# EAGLE design untitled (EAGLE 8.2.2)
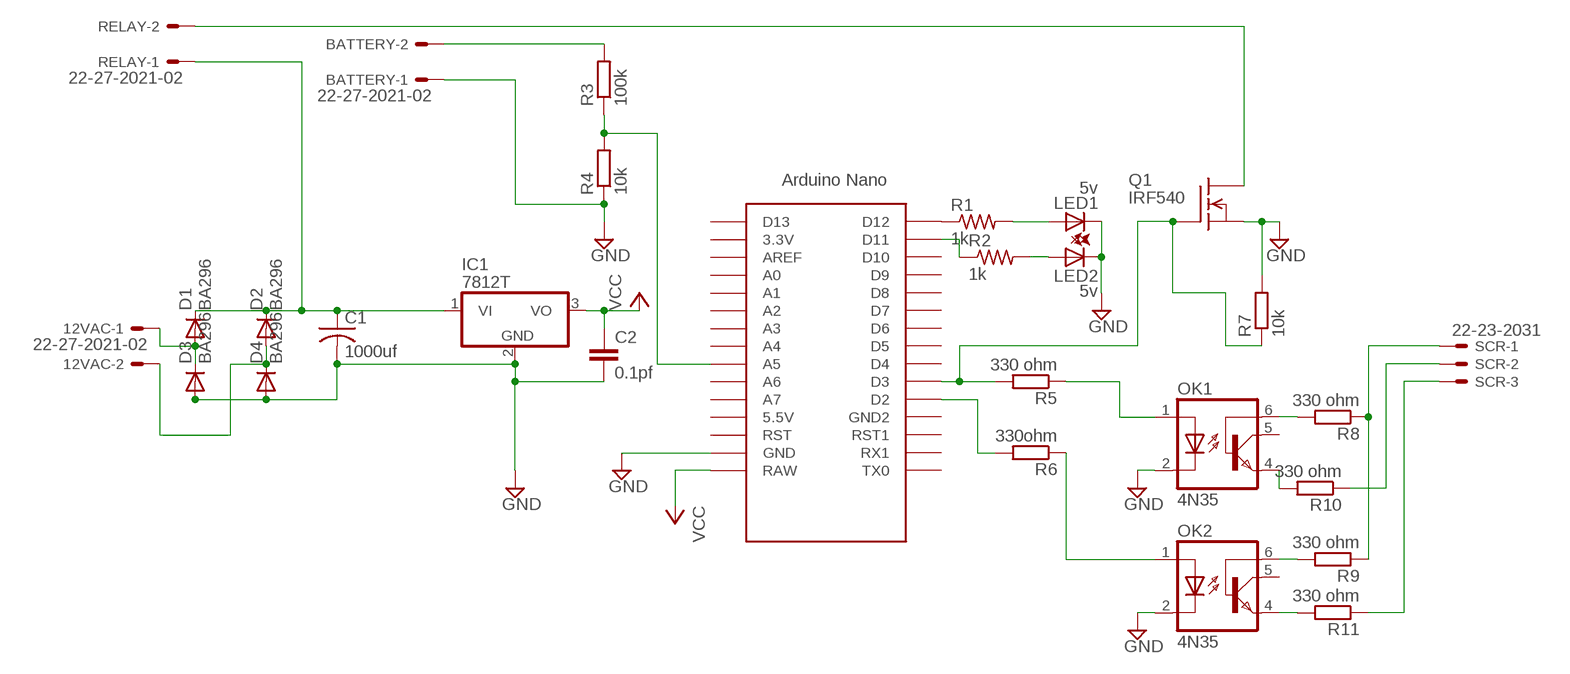
[diagram p0: schematic, sheet 1]

## Parts
12VAC  22-27-2021-02  [6410-02]
BATTERY  22-27-2021-02  [6410-02]
C1  1000uf  C-US050-025X075  [C050-025X075]
C2  0.1pf  C7.5/4  [C7.5B4]
D1  BA296  [P2-15]
D2  BA296  [P2-15]
D3  BA296  [P2-15]
D4  BA296  [P2-15]
IC1  7812T  [TO220H]
LED1  5v  LED_E  [LED_1206]
LED2  5v  LED_E  [LED_1206]
OK1  4N35  [DIL06]
OK2  4N35  [DIL06]
Q1  IRF540  [TO220]
R1  1k  R-US_0207/2V  [0207/2V]
R2  1k  R-US_0207/2V  [0207/2V]
R3  100k  R0207/10  [0207/10]
R4  10k  R0207/10  [0207/10]
R5  330 ohm  R0207/10  [0207/10]
R6  330ohm  R0207/10  [0207/10]
R7  10k  R0207/10  [0207/10]
R8  330 ohm  R0207/10  [0207/10]
R9  330 ohm  R0207/10  [0207/10]
R10  330 ohm  R0207/10  [0207/10]
R11  330 ohm  R0207/10  [0207/10]
RELAY  22-27-2021-02  [6410-02]
SCR  22-23-2031  [22-23-2031]
U$1  NANO  [NANO]

## Nets
GND: BATTERY.1 C1.2 C2.2 D3.A D4.A IC1.2(GND) LED1.C LED2.C OK1.2(C) OK2.2(C) Q1.3(S) R4.1 R7.2 U$1.GND
N$1: R10.1 SCR.2
N$3: R6.2 U$1.D2
N$4: BATTERY.2 R3.2
N$5: 12VAC.1 D1.A D3.C
N$6: 12VAC.2 D2.A D4.C
N$7: R1.1 U$1.D12
N$8: LED2.A R2.2
N$9: LED1.A R1.2
N$10: R2.1 U$1.D11
N$11: Q1.1(G) R5.2 R7.1 U$1.D3
N$12: OK1.1(A) R5.1
N$13: R3.1 R4.2 U$1.A5
N$15: OK2.1(A) R6.1
N$16: Q1.2(D) RELAY.2
N$17: C1.1 D1.C D2.C IC1.1(VI) RELAY.1
N$18: R11.1 SCR.3
N$19: OK1.4(EMI) R10.2
N$20: R8.1 R9.1 SCR.1
N$21: OK1.6(BAS) R8.2
N$22: OK2.6(BAS) R9.2
N$23: OK2.4(EMI) R11.2
VCC: C2.1 IC1.3(VO) U$1.RAW
Unconnected: OK1.5(COL) OK2.5(COL) U$1.3.3V U$1.5V(5.5V) U$1.A0 U$1.A1 U$1.A2 U$1.A3 U$1.A4 U$1.A6 U$1.A7 U$1.AREF U$1.D4 U$1.D5 U$1.D6 U$1.D7 U$1.D8 U$1.D9 U$1.D10 U$1.D13 U$1.GND1(GND2) U$1.ICSP1 U$1.ICSP2 U$1.ICSP3 U$1.ICSP4 U$1.ICSP5 U$1.ICSP6 U$1.RST U$1.RST1 U$1.RX1 U$1.TX0

## Library data of the parts
12VAC BATTERY RELAY = con-molex:22-?-02: CONNECTOR wire to board 2.54 mm (.1 inch) pitch header; OC_FARNELL: unknown; OC_NEWARK: unknown
C1 = rcl:C-US: CAPACITOR, American symbol; C1: 1000uf
C2 = capacitor-wima:C: CAPACITOR naming: grid - package width; C2: 0.1pf
D1-D4 = diode:BA296: DIODE
IC1 = linear:78*: Positive VOLTAGE REGULATOR Source: http://cache.national.com/ds/LM/LM78L05.pdf http://www.fairchildsemi.com/ds/LM/LM7805.pdf
LED1 LED2 = eagle-ltspice:LED_E: LED Source: http://www.osram.convergy.de Source: www.luxeon.com Source: www.kingbright.com; SPICEMODEL: NONE; SPICEPREFIX: D; SPICETYPE: diode
OK1 OK2 = optocoupler:4N35: MOTOROLA OPTO COUPLER; MF: FAIRCHILD SEMICONDUCTOR; MPN: 4N35; OC_FARNELL: 1328375; OC_NEWARK: 72K9946
Q1 = transistor-fet:IRF540: N-Channel Enhancement MOSFET (HEXFET); 100V; 28A; 0,077Ohm
R1 = rcl:R-US_: RESISTOR, American symbol; R1: 1k
R2 = rcl:R-US_: RESISTOR, American symbol; R2: 1k
R3-R11 = eagle-ltspice:R: RESISTOR, European symbol; SPICEMODEL: NONE; SPICEPREFIX: R
SCR = con-molex:22-23-2031: .100" (2.54mm) Center Header - 3 Pin; MF: MOLEX; MPN: 22-23-2031; OC_FARNELL: 1462950; OC_NEWARK: 30C0862
U$1 = Arduino-clone:NANO: Arduino Nano

## Net classes
0 mine: width 0.61 mm, drill 0.762 mm, clearance 0.152 mm

## Board
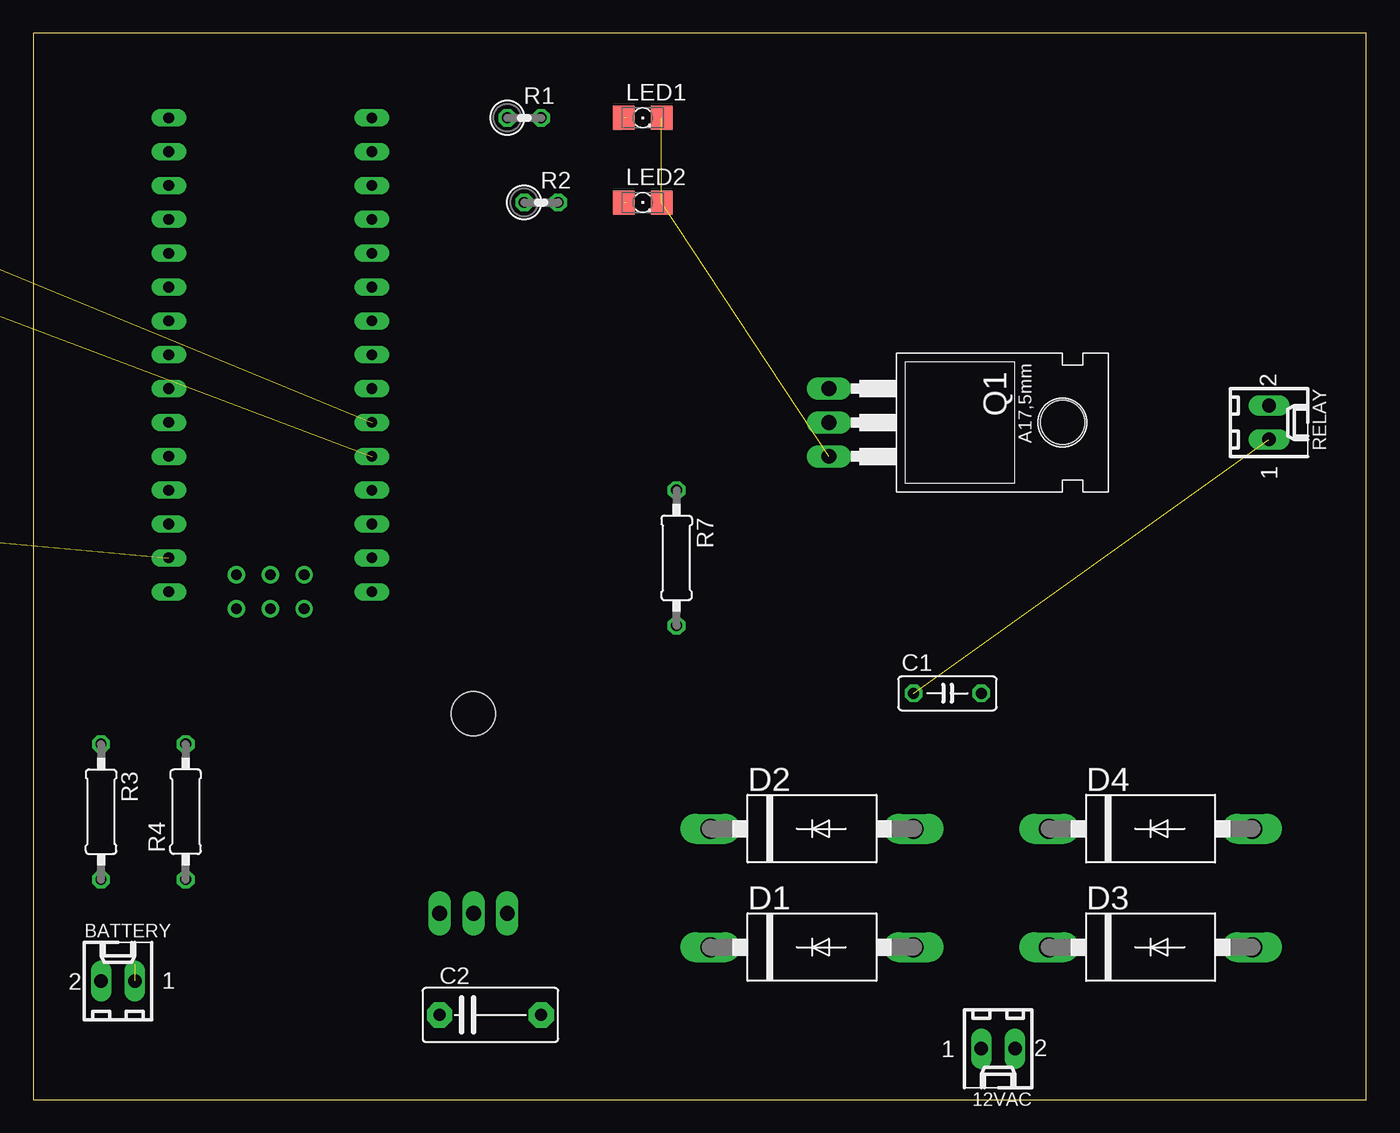
[diagram p1: board, top side]
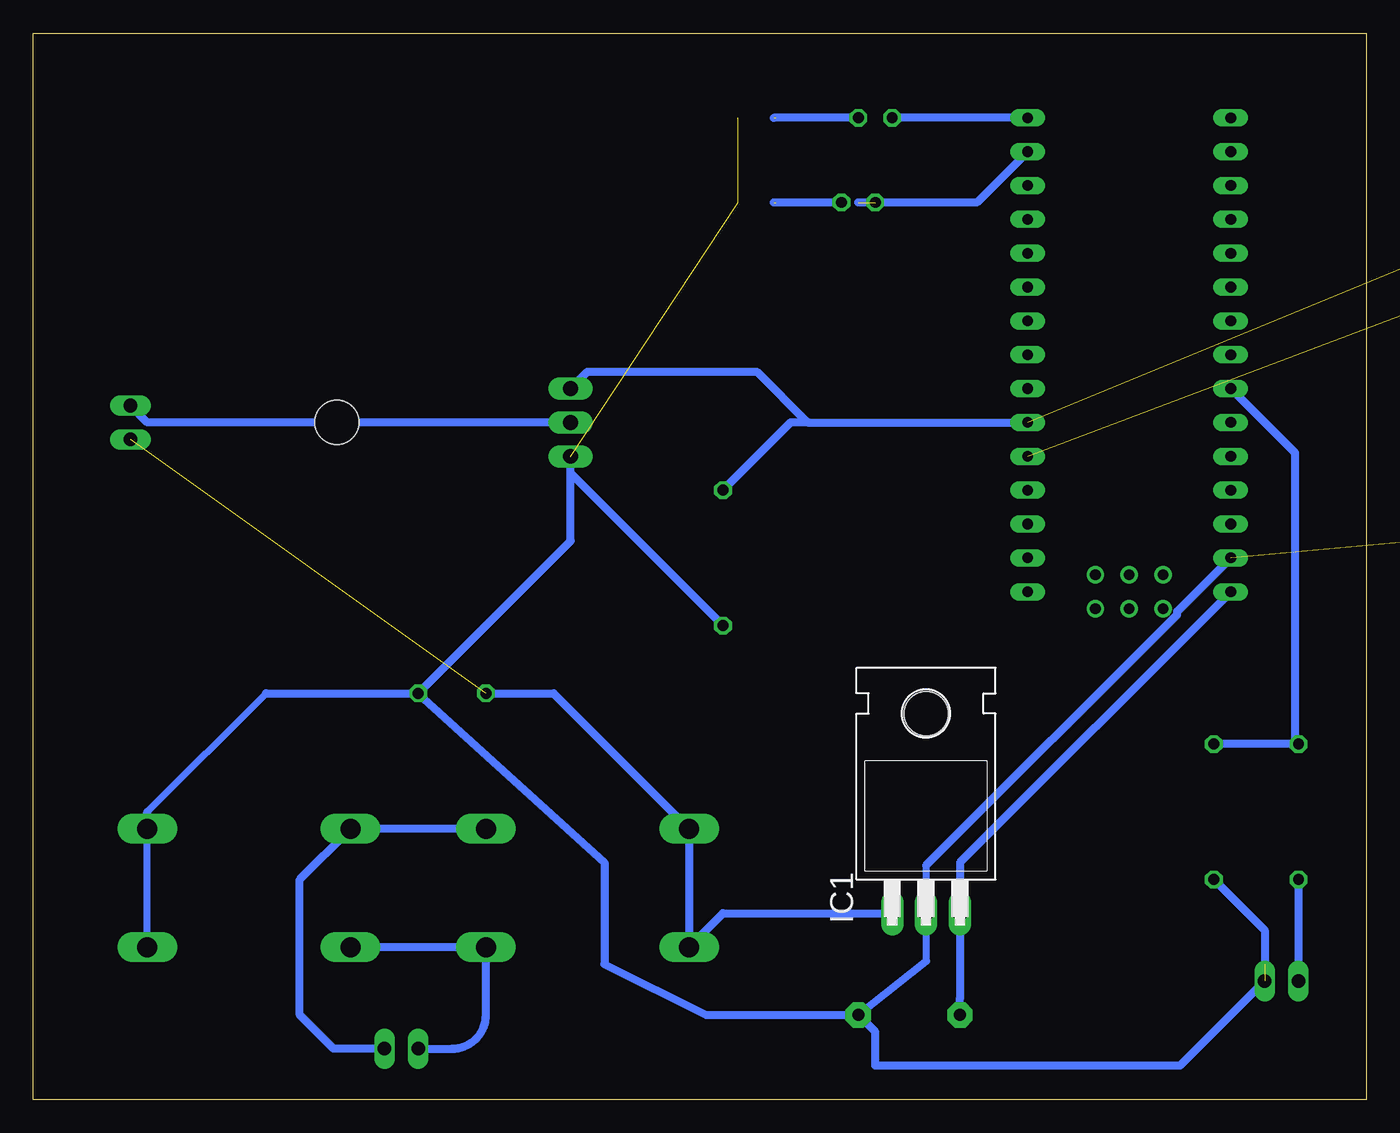
[diagram p2: board, bottom side, seen from below]

Size 100 x 80 mm. Coordinates in mm from the lower left corner, seen from the top.
Outline: 0,0 100,0 100,80 0,80 0,0
Copper layers (1*16): Top 0.035mm / dielectric 1.5mm / Bottom 0.035mm
Design rules "default": minimum track width 6mil, minimum drill 0.35mm, track to track 6mil, track to pad 6mil, pad to pad 6mil, via to via 6mil, smd to smd 6mil, copper to edge 40mil, drill to drill 6mil, minimum pad ring 10mil, minimum via ring 8mil, stop-mask expansion 4mil, vias tented up to drill 0mil, thermal gap 10mil

### Footprints (pad centres in the part's own frame; a part is rotated, then mirrored left to right if it is on the bottom)
6410-02 = drill 1.016 long: 1 1.27,0; 2 -1.27,0
C050-025X075 = drill 0.813 octagon: 1 -2.54,0; 2 2.54,0
C7.5B4 = drill 0.914 pad 1.905 octagon: 1 -3.81,0; 2 3.81,0
P2-15 = drill 1.499 long: A 7.62,0; C -7.62,0
TO220H = drill 1.118 long: 1 -2.54,-10.16; 2 0,-10.16; 3 2.54,-10.16 | hole 3.302: 0,4.826
LED_1206 = smd 1.6 x 1.803: A -1.422,0; C 1.422,0
DIL06 = drill 0.813 offset: 1 -2.54,-3.81; 2 0,-3.81; 3 2.54,-3.81; 4 2.54,3.81; 5 0,3.81; 6 -2.54,3.81
TO220 = drill 1.118 long: 1 -2.54,-6.35; 2 0,-6.35; 3 2.54,-6.35 | hole 3.302: 0,11.176
0207/2V = drill 0.813 octagon: 1 -1.27,0; 2 1.27,0
0207/10 = drill 0.813 octagon: 1 -5.08,0; 2 5.08,0
22-23-2031 = drill 1 long: 1 -2.54,0; 2 0,0; 3 2.54,0
NANO = drill 0.8 long: 3.3V -10.16,24.13; 5V -10.16,-1.27; A0 -10.16,19.05; A1 -10.16,16.51; A2 -10.16,13.97; A3 -10.16,11.43; A4 -10.16,8.89; A5 -10.16,6.35; A6 -10.16,3.81; A7 -10.16,1.27; AREF -10.16,21.59; D2 5.08,1.27; D3 5.08,3.81; D4 5.08,6.35; D5 5.08,8.89; D6 5.08,11.43; D7 5.08,13.97; D8 5.08,16.51; D9 5.08,19.05; D10 5.08,21.59; D11 5.08,24.13; D12 5.08,26.67; D13 -10.16,26.67; GND -10.16,-6.35; GND1 5.08,-1.27; RAW -10.16,-8.89; RST -10.16,-3.81; RST1 5.08,-3.81; RX1 5.08,-6.35; TX0 5.08,-8.89 | drill 0.8: ICSP1 -5.08,-10.16; ICSP2 -5.08,-7.62; ICSP3 -2.54,-10.16; ICSP4 -2.54,-7.62; ICSP5 0,-10.16; ICSP6 0,-7.62

### Placement (x,y rotation side)
12VAC  72.39,3.81 180 top
BATTERY  6.35,8.89 0 top
C1  68.58,30.48 0 top
C2  34.29,6.35 0 top
D1  58.42,11.43 0 top
D2  58.42,20.32 0 top
D3  83.82,11.43 0 top
D4  83.82,20.32 0 top
IC1  33.02,24.13 0 bottom
LED1  45.72,73.66 0 top
LED2  45.72,67.31 0 top
OK1  -64.77,7.62 0 top  (outside the outline)
OK2  -17.78,46.99 0 top  (outside the outline)
Q1  66.04,50.8 270 top
R1  36.83,73.66 0 top
R2  38.1,67.31 0 top
R3  5.08,21.59 270 top
R4  11.43,21.59 90 top
R5  -44.45,77.47 0 top  (outside the outline)
R6  -57.15,77.47 0 top  (outside the outline)
R7  48.26,40.64 270 top
R8  -31.75,82.55 0 top  (outside the outline)
R9  -44.45,82.55 0 top  (outside the outline)
R10  -57.15,82.55 0 top  (outside the outline)
R11  -19.05,87.63 0 top  (outside the outline)
RELAY  92.71,50.8 270 top
SCR  -27.94,45.72 0 top  (outside the outline)
U$1  20.32,46.99 0 top

### Tracks (layer width: path | path; a pad name or v marks a point on that pad's centre or on a via)
GND  (5 unrouted)
  Bottom 0.508: D3.A D4.A | 33.02,10.38 IC1.2 33.02,17.55 | 91.44,21.59 82.55,30.48 | 14.18,36.62 14.18,36.39
  Bottom 0.61: C2.2 33.02,10.38 | 82.55,30.48 C1.2 | D4.A 91.44,21.59 | C1.2 57.15,17.78 57.15,10.16 49.53,6.35 C2.2 | BATTERY.1 13.97,2.54 36.83,2.54 36.83,5.08 C2.2 | R4.1 7.62,12.7 7.62,10.16 | U$1.GND 14.18,36.62 | 14.18,36.39 33.02,17.55 | C1.2 59.69,41.91 Q1.3 59.69,46.99 R7.2
N$1  (1 unrouted)
N$3  (1 unrouted)
N$4
  Bottom 0.61: R3.2 BATTERY.2
N$5
  Bottom 0.61: 12VAC.1 68.58,3.81 arc-90 66.04,6.35 D1.A D3.C
N$6
  Bottom 0.305: D4.C 76.32,20.2
  Bottom 0.61: 12VAC.2 77.47,3.81 80.01,6.35 80.01,16.51 76.32,20.2 | D2.A D4.C
N$7
  Bottom 0.61: U$1.D12 R1.1
N$8  (1 unrouted)
  Bottom 0.61: R2.2 44.45,67.31
N$9  (1 unrouted)
  Bottom 0.61: R1.2 44.45,73.66
N$10  (1 unrouted)
  Bottom 0.61: U$1.D11 29.21,67.31 38.1,67.31
N$11  (1 unrouted)
  Bottom 0.61: R7.1 43.18,50.8 41.82,50.8 | 41.82,50.8 U$1.D3 | Q1.1 58.42,54.61 45.72,54.61 41.91,50.8 41.82,50.8
N$12  (1 unrouted)
N$13
  Bottom 0.508: 5.35,26.67 R3.1
  Bottom 0.61: R4.2 5.35,26.67 5.35,48.53 U$1.A5
N$15  (1 unrouted)
N$16
  Bottom 0.61: Q1.2 91.44,50.8 RELAY.2
N$17  (1 unrouted)
  Bottom 0.61: IC1.1 48.26,13.97 D1.C D2.C 60.96,30.48 C1.1
N$18  (1 unrouted)
N$19  (1 unrouted)
N$20  (2 unrouted)
N$21  (1 unrouted)
N$22  (1 unrouted)
N$23  (1 unrouted)
VCC
  Bottom 0.61: C2.1 30.47,7.63 IC1.3 30.48,17.78 U$1.RAW